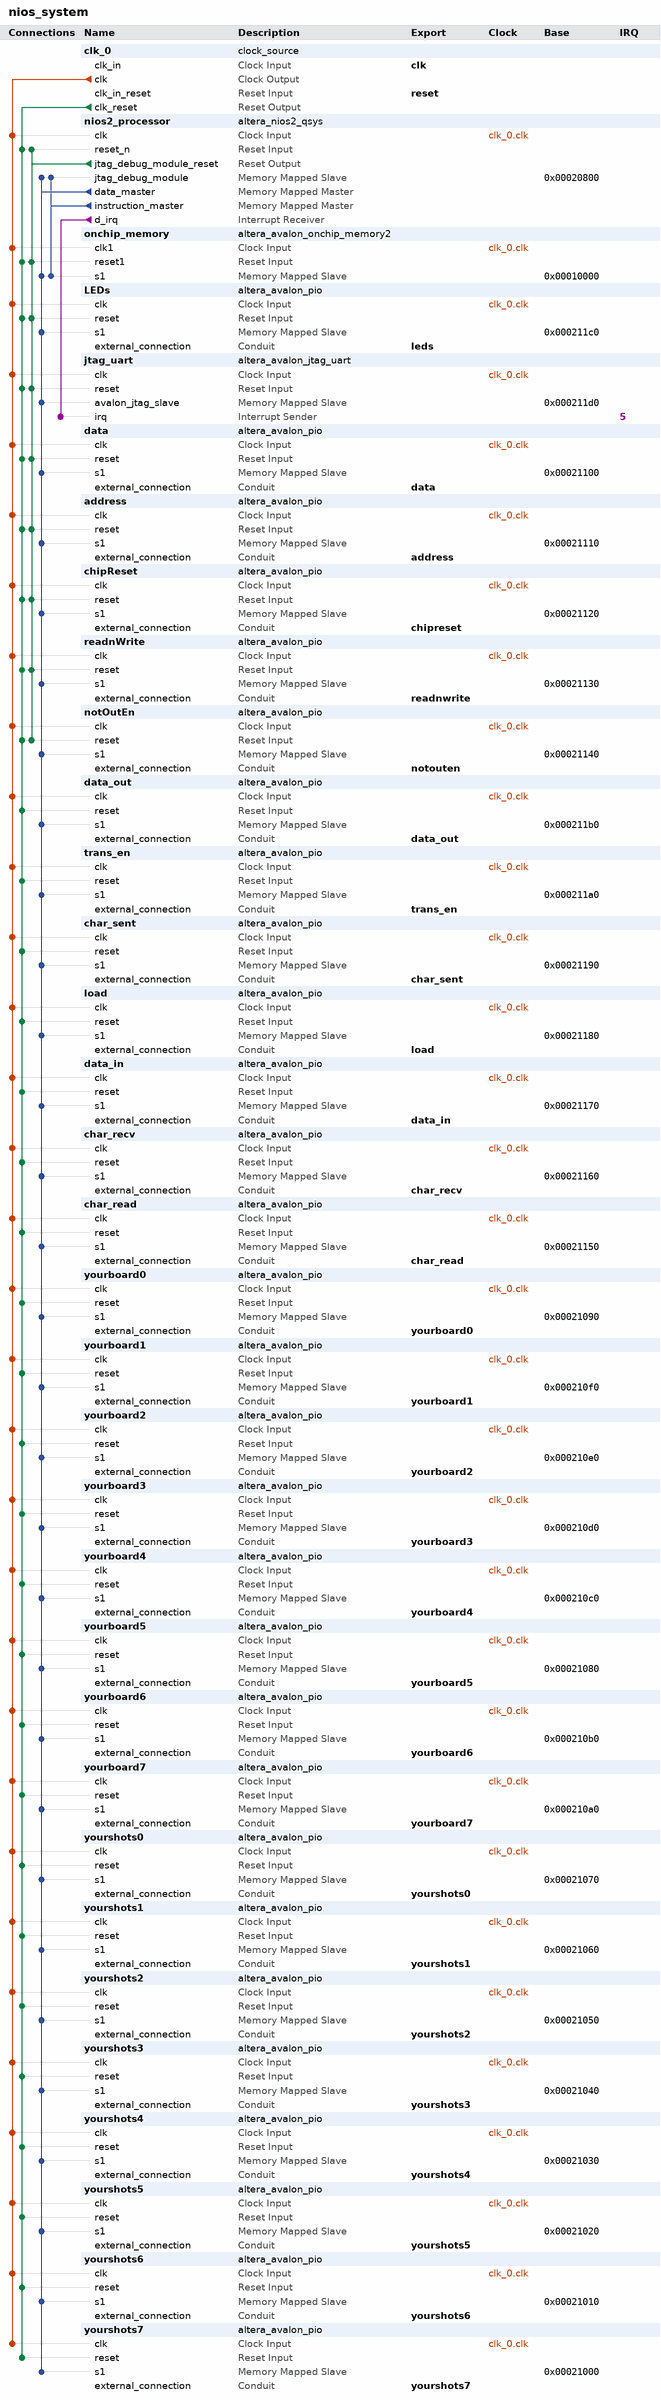
[diagram p0: system contents]
# Platform Designer (Qsys) system nios_system, Cyclone V 5CSEMA5F31C6
# Parameters at their usual value, and those the tool derives, are not listed.
package require -exact qsys 15.1
create_system nios_system
set_project_property DEVICE_FAMILY {Cyclone V}
set_project_property DEVICE 5CSEMA5F31C6

add_instance clk_0 clock_source 15.1
set_instance_parameter_value clk_0 clockFrequency 50000000

add_instance nios2_processor altera_nios2_qsys 15.1
set_instance_parameter_value nios2_processor breakSlave nios2_processor.jtag_debug_module
set_instance_parameter_value nios2_processor exceptionSlave onchip_memory.s1
set_instance_parameter_value nios2_processor icache_size 4096
set_instance_parameter_value nios2_processor impl Tiny
set_instance_parameter_value nios2_processor mmu_TLBMissExcSlave None
set_instance_parameter_value nios2_processor resetSlave onchip_memory.s1
set_instance_parameter_value nios2_processor resetrequest_enabled true

add_instance onchip_memory altera_avalon_onchip_memory2 15.1
set_instance_parameter_value onchip_memory dataWidth 32
set_instance_parameter_value onchip_memory dualPort false
set_instance_parameter_value onchip_memory initMemContent true
set_instance_parameter_value onchip_memory initializationFileName onchip_mem.hex
set_instance_parameter_value onchip_memory memorySize 65536

add_instance LEDs altera_avalon_pio 15.1
set_instance_parameter_value LEDs direction Output
set_instance_parameter_value LEDs width 8

add_instance jtag_uart altera_avalon_jtag_uart 15.1
set_instance_parameter_value jtag_uart simInteractiveOptions NO_INTERACTIVE_WINDOWS

add_instance data altera_avalon_pio 15.1
set_instance_parameter_value data direction Bidir
set_instance_parameter_value data width 8

add_instance address altera_avalon_pio 15.1
set_instance_parameter_value address direction Output
set_instance_parameter_value address width 11

add_instance chipReset altera_avalon_pio 15.1
set_instance_parameter_value chipReset direction Output
set_instance_parameter_value chipReset width 1

add_instance readnWrite altera_avalon_pio 15.1
set_instance_parameter_value readnWrite direction Output
set_instance_parameter_value readnWrite width 1

add_instance notOutEn altera_avalon_pio 15.1
set_instance_parameter_value notOutEn direction Output
set_instance_parameter_value notOutEn width 1

add_instance data_out altera_avalon_pio 15.1
set_instance_parameter_value data_out direction Output
set_instance_parameter_value data_out width 8

add_instance trans_en altera_avalon_pio 15.1
set_instance_parameter_value trans_en direction Output
set_instance_parameter_value trans_en width 1

add_instance char_sent altera_avalon_pio 15.1
set_instance_parameter_value char_sent direction Input
set_instance_parameter_value char_sent width 1

add_instance load altera_avalon_pio 15.1
set_instance_parameter_value load direction Output
set_instance_parameter_value load width 1

add_instance data_in altera_avalon_pio 15.1
set_instance_parameter_value data_in direction Input
set_instance_parameter_value data_in width 8

add_instance char_recv altera_avalon_pio 15.1
set_instance_parameter_value char_recv direction Input
set_instance_parameter_value char_recv width 1

add_instance char_read altera_avalon_pio 15.1
set_instance_parameter_value char_read direction Output
set_instance_parameter_value char_read width 1

add_instance yourboard0 altera_avalon_pio 15.1
set_instance_parameter_value yourboard0 direction Output
set_instance_parameter_value yourboard0 width 8

add_instance yourboard1 altera_avalon_pio 15.1
set_instance_parameter_value yourboard1 direction Output
set_instance_parameter_value yourboard1 width 8

add_instance yourboard2 altera_avalon_pio 15.1
set_instance_parameter_value yourboard2 direction Output
set_instance_parameter_value yourboard2 width 8

add_instance yourboard3 altera_avalon_pio 15.1
set_instance_parameter_value yourboard3 direction Output
set_instance_parameter_value yourboard3 width 8

add_instance yourboard4 altera_avalon_pio 15.1
set_instance_parameter_value yourboard4 direction Output
set_instance_parameter_value yourboard4 width 8

add_instance yourboard5 altera_avalon_pio 15.1
set_instance_parameter_value yourboard5 direction Output
set_instance_parameter_value yourboard5 width 8

add_instance yourboard6 altera_avalon_pio 15.1
set_instance_parameter_value yourboard6 direction Output
set_instance_parameter_value yourboard6 width 8

add_instance yourboard7 altera_avalon_pio 15.1
set_instance_parameter_value yourboard7 direction Output
set_instance_parameter_value yourboard7 width 8

add_instance yourshots0 altera_avalon_pio 15.1
set_instance_parameter_value yourshots0 direction Output
set_instance_parameter_value yourshots0 width 8

add_instance yourshots1 altera_avalon_pio 15.1
set_instance_parameter_value yourshots1 direction Output
set_instance_parameter_value yourshots1 width 8

add_instance yourshots2 altera_avalon_pio 15.1
set_instance_parameter_value yourshots2 direction Output
set_instance_parameter_value yourshots2 width 8

add_instance yourshots3 altera_avalon_pio 15.1
set_instance_parameter_value yourshots3 direction Output
set_instance_parameter_value yourshots3 width 8

add_instance yourshots4 altera_avalon_pio 15.1
set_instance_parameter_value yourshots4 direction Output
set_instance_parameter_value yourshots4 width 8

add_instance yourshots5 altera_avalon_pio 15.1
set_instance_parameter_value yourshots5 direction Output
set_instance_parameter_value yourshots5 width 8

add_instance yourshots6 altera_avalon_pio 15.1
set_instance_parameter_value yourshots6 direction Output
set_instance_parameter_value yourshots6 width 8

add_instance yourshots7 altera_avalon_pio 15.1
set_instance_parameter_value yourshots7 direction Output
set_instance_parameter_value yourshots7 width 8

# connections
add_connection clk_0.clk address.clk clock
add_connection clk_0.clk char_read.clk clock
add_connection clk_0.clk char_recv.clk clock
add_connection clk_0.clk char_sent.clk clock
add_connection clk_0.clk chipReset.clk clock
add_connection clk_0.clk data.clk clock
add_connection clk_0.clk data_in.clk clock
add_connection clk_0.clk data_out.clk clock
add_connection clk_0.clk jtag_uart.clk clock
add_connection clk_0.clk LEDs.clk clock
add_connection clk_0.clk load.clk clock
add_connection clk_0.clk nios2_processor.clk clock
add_connection clk_0.clk notOutEn.clk clock
add_connection clk_0.clk onchip_memory.clk1 clock
add_connection clk_0.clk readnWrite.clk clock
add_connection clk_0.clk trans_en.clk clock
add_connection clk_0.clk yourboard0.clk clock
add_connection clk_0.clk yourboard1.clk clock
add_connection clk_0.clk yourboard2.clk clock
add_connection clk_0.clk yourboard3.clk clock
add_connection clk_0.clk yourboard4.clk clock
add_connection clk_0.clk yourboard5.clk clock
add_connection clk_0.clk yourboard6.clk clock
add_connection clk_0.clk yourboard7.clk clock
add_connection clk_0.clk yourshots0.clk clock
add_connection clk_0.clk yourshots1.clk clock
add_connection clk_0.clk yourshots2.clk clock
add_connection clk_0.clk yourshots3.clk clock
add_connection clk_0.clk yourshots4.clk clock
add_connection clk_0.clk yourshots5.clk clock
add_connection clk_0.clk yourshots6.clk clock
add_connection clk_0.clk yourshots7.clk clock
add_connection clk_0.clk_reset address.reset reset
add_connection clk_0.clk_reset char_read.reset reset
add_connection clk_0.clk_reset char_recv.reset reset
add_connection clk_0.clk_reset char_sent.reset reset
add_connection clk_0.clk_reset chipReset.reset reset
add_connection clk_0.clk_reset data.reset reset
add_connection clk_0.clk_reset data_in.reset reset
add_connection clk_0.clk_reset data_out.reset reset
add_connection clk_0.clk_reset jtag_uart.reset reset
add_connection clk_0.clk_reset LEDs.reset reset
add_connection clk_0.clk_reset load.reset reset
add_connection clk_0.clk_reset nios2_processor.reset_n reset
add_connection clk_0.clk_reset notOutEn.reset reset
add_connection clk_0.clk_reset onchip_memory.reset1 reset
add_connection clk_0.clk_reset readnWrite.reset reset
add_connection clk_0.clk_reset trans_en.reset reset
add_connection clk_0.clk_reset yourboard0.reset reset
add_connection clk_0.clk_reset yourboard1.reset reset
add_connection clk_0.clk_reset yourboard2.reset reset
add_connection clk_0.clk_reset yourboard3.reset reset
add_connection clk_0.clk_reset yourboard4.reset reset
add_connection clk_0.clk_reset yourboard5.reset reset
add_connection clk_0.clk_reset yourboard6.reset reset
add_connection clk_0.clk_reset yourboard7.reset reset
add_connection clk_0.clk_reset yourshots0.reset reset
add_connection clk_0.clk_reset yourshots1.reset reset
add_connection clk_0.clk_reset yourshots2.reset reset
add_connection clk_0.clk_reset yourshots3.reset reset
add_connection clk_0.clk_reset yourshots4.reset reset
add_connection clk_0.clk_reset yourshots5.reset reset
add_connection clk_0.clk_reset yourshots6.reset reset
add_connection clk_0.clk_reset yourshots7.reset reset
add_connection nios2_processor.jtag_debug_module_reset address.reset reset
add_connection nios2_processor.jtag_debug_module_reset chipReset.reset reset
add_connection nios2_processor.jtag_debug_module_reset data.reset reset
add_connection nios2_processor.jtag_debug_module_reset jtag_uart.reset reset
add_connection nios2_processor.jtag_debug_module_reset LEDs.reset reset
add_connection nios2_processor.jtag_debug_module_reset nios2_processor.reset_n reset
add_connection nios2_processor.jtag_debug_module_reset notOutEn.reset reset
add_connection nios2_processor.jtag_debug_module_reset onchip_memory.reset1 reset
add_connection nios2_processor.jtag_debug_module_reset readnWrite.reset reset
add_connection nios2_processor.data_master address.s1 avalon
set_connection_parameter_value nios2_processor.data_master/address.s1 baseAddress 0x00021110
add_connection nios2_processor.data_master char_read.s1 avalon
set_connection_parameter_value nios2_processor.data_master/char_read.s1 baseAddress 0x00021150
add_connection nios2_processor.data_master char_recv.s1 avalon
set_connection_parameter_value nios2_processor.data_master/char_recv.s1 baseAddress 0x00021160
add_connection nios2_processor.data_master char_sent.s1 avalon
set_connection_parameter_value nios2_processor.data_master/char_sent.s1 baseAddress 0x00021190
add_connection nios2_processor.data_master chipReset.s1 avalon
set_connection_parameter_value nios2_processor.data_master/chipReset.s1 baseAddress 0x00021120
add_connection nios2_processor.data_master data.s1 avalon
set_connection_parameter_value nios2_processor.data_master/data.s1 baseAddress 0x00021100
add_connection nios2_processor.data_master data_in.s1 avalon
set_connection_parameter_value nios2_processor.data_master/data_in.s1 baseAddress 0x00021170
add_connection nios2_processor.data_master data_out.s1 avalon
set_connection_parameter_value nios2_processor.data_master/data_out.s1 baseAddress 0x000211b0
add_connection nios2_processor.data_master jtag_uart.avalon_jtag_slave avalon
set_connection_parameter_value nios2_processor.data_master/jtag_uart.avalon_jtag_slave baseAddress 0x000211d0
add_connection nios2_processor.data_master LEDs.s1 avalon
set_connection_parameter_value nios2_processor.data_master/LEDs.s1 baseAddress 0x000211c0
add_connection nios2_processor.data_master load.s1 avalon
set_connection_parameter_value nios2_processor.data_master/load.s1 baseAddress 0x00021180
add_connection nios2_processor.data_master nios2_processor.jtag_debug_module avalon
set_connection_parameter_value nios2_processor.data_master/nios2_processor.jtag_debug_module baseAddress 0x00020800
add_connection nios2_processor.data_master notOutEn.s1 avalon
set_connection_parameter_value nios2_processor.data_master/notOutEn.s1 baseAddress 0x00021140
add_connection nios2_processor.data_master onchip_memory.s1 avalon
set_connection_parameter_value nios2_processor.data_master/onchip_memory.s1 baseAddress 0x00010000
add_connection nios2_processor.data_master readnWrite.s1 avalon
set_connection_parameter_value nios2_processor.data_master/readnWrite.s1 baseAddress 0x00021130
add_connection nios2_processor.data_master trans_en.s1 avalon
set_connection_parameter_value nios2_processor.data_master/trans_en.s1 baseAddress 0x000211a0
add_connection nios2_processor.data_master yourboard0.s1 avalon
set_connection_parameter_value nios2_processor.data_master/yourboard0.s1 baseAddress 0x00021090
add_connection nios2_processor.data_master yourboard1.s1 avalon
set_connection_parameter_value nios2_processor.data_master/yourboard1.s1 baseAddress 0x000210f0
add_connection nios2_processor.data_master yourboard2.s1 avalon
set_connection_parameter_value nios2_processor.data_master/yourboard2.s1 baseAddress 0x000210e0
add_connection nios2_processor.data_master yourboard3.s1 avalon
set_connection_parameter_value nios2_processor.data_master/yourboard3.s1 baseAddress 0x000210d0
add_connection nios2_processor.data_master yourboard4.s1 avalon
set_connection_parameter_value nios2_processor.data_master/yourboard4.s1 baseAddress 0x000210c0
add_connection nios2_processor.data_master yourboard5.s1 avalon
set_connection_parameter_value nios2_processor.data_master/yourboard5.s1 baseAddress 0x00021080
add_connection nios2_processor.data_master yourboard6.s1 avalon
set_connection_parameter_value nios2_processor.data_master/yourboard6.s1 baseAddress 0x000210b0
add_connection nios2_processor.data_master yourboard7.s1 avalon
set_connection_parameter_value nios2_processor.data_master/yourboard7.s1 baseAddress 0x000210a0
add_connection nios2_processor.data_master yourshots0.s1 avalon
set_connection_parameter_value nios2_processor.data_master/yourshots0.s1 baseAddress 0x00021070
add_connection nios2_processor.data_master yourshots1.s1 avalon
set_connection_parameter_value nios2_processor.data_master/yourshots1.s1 baseAddress 0x00021060
add_connection nios2_processor.data_master yourshots2.s1 avalon
set_connection_parameter_value nios2_processor.data_master/yourshots2.s1 baseAddress 0x00021050
add_connection nios2_processor.data_master yourshots3.s1 avalon
set_connection_parameter_value nios2_processor.data_master/yourshots3.s1 baseAddress 0x00021040
add_connection nios2_processor.data_master yourshots4.s1 avalon
set_connection_parameter_value nios2_processor.data_master/yourshots4.s1 baseAddress 0x00021030
add_connection nios2_processor.data_master yourshots5.s1 avalon
set_connection_parameter_value nios2_processor.data_master/yourshots5.s1 baseAddress 0x00021020
add_connection nios2_processor.data_master yourshots6.s1 avalon
set_connection_parameter_value nios2_processor.data_master/yourshots6.s1 baseAddress 0x00021010
add_connection nios2_processor.data_master yourshots7.s1 avalon
set_connection_parameter_value nios2_processor.data_master/yourshots7.s1 baseAddress 0x00021000
add_connection nios2_processor.instruction_master nios2_processor.jtag_debug_module avalon
set_connection_parameter_value nios2_processor.instruction_master/nios2_processor.jtag_debug_module baseAddress 0x00020800
add_connection nios2_processor.instruction_master onchip_memory.s1 avalon
set_connection_parameter_value nios2_processor.instruction_master/onchip_memory.s1 baseAddress 0x00010000
add_connection nios2_processor.d_irq jtag_uart.irq interrupt
set_connection_parameter_value nios2_processor.d_irq/jtag_uart.irq irqNumber 5

# exported interfaces
add_interface address conduit end
set_interface_property address EXPORT_OF address.external_connection
add_interface char_read conduit end
set_interface_property char_read EXPORT_OF char_read.external_connection
add_interface char_recv conduit end
set_interface_property char_recv EXPORT_OF char_recv.external_connection
add_interface char_sent conduit end
set_interface_property char_sent EXPORT_OF char_sent.external_connection
add_interface chipreset conduit end
set_interface_property chipreset EXPORT_OF chipReset.external_connection
add_interface clk clock sink
set_interface_property clk EXPORT_OF clk_0.clk_in
add_interface data conduit end
set_interface_property data EXPORT_OF data.external_connection
add_interface data_in conduit end
set_interface_property data_in EXPORT_OF data_in.external_connection
add_interface data_out conduit end
set_interface_property data_out EXPORT_OF data_out.external_connection
add_interface leds conduit end
set_interface_property leds EXPORT_OF LEDs.external_connection
add_interface load conduit end
set_interface_property load EXPORT_OF load.external_connection
add_interface notouten conduit end
set_interface_property notouten EXPORT_OF notOutEn.external_connection
add_interface readnwrite conduit end
set_interface_property readnwrite EXPORT_OF readnWrite.external_connection
add_interface reset reset sink
set_interface_property reset EXPORT_OF clk_0.clk_in_reset
add_interface trans_en conduit end
set_interface_property trans_en EXPORT_OF trans_en.external_connection
add_interface yourboard0 conduit end
set_interface_property yourboard0 EXPORT_OF yourboard0.external_connection
add_interface yourboard1 conduit end
set_interface_property yourboard1 EXPORT_OF yourboard1.external_connection
add_interface yourboard2 conduit end
set_interface_property yourboard2 EXPORT_OF yourboard2.external_connection
add_interface yourboard3 conduit end
set_interface_property yourboard3 EXPORT_OF yourboard3.external_connection
add_interface yourboard4 conduit end
set_interface_property yourboard4 EXPORT_OF yourboard4.external_connection
add_interface yourboard5 conduit end
set_interface_property yourboard5 EXPORT_OF yourboard5.external_connection
add_interface yourboard6 conduit end
set_interface_property yourboard6 EXPORT_OF yourboard6.external_connection
add_interface yourboard7 conduit end
set_interface_property yourboard7 EXPORT_OF yourboard7.external_connection
add_interface yourshots0 conduit end
set_interface_property yourshots0 EXPORT_OF yourshots0.external_connection
add_interface yourshots1 conduit end
set_interface_property yourshots1 EXPORT_OF yourshots1.external_connection
add_interface yourshots2 conduit end
set_interface_property yourshots2 EXPORT_OF yourshots2.external_connection
add_interface yourshots3 conduit end
set_interface_property yourshots3 EXPORT_OF yourshots3.external_connection
add_interface yourshots4 conduit end
set_interface_property yourshots4 EXPORT_OF yourshots4.external_connection
add_interface yourshots5 conduit end
set_interface_property yourshots5 EXPORT_OF yourshots5.external_connection
add_interface yourshots6 conduit end
set_interface_property yourshots6 EXPORT_OF yourshots6.external_connection
add_interface yourshots7 conduit end
set_interface_property yourshots7 EXPORT_OF yourshots7.external_connection

set_interconnect_requirement {$system} qsys_mm.clockCrossingAdapter HANDSHAKE
set_interconnect_requirement {$system} qsys_mm.enableEccProtection FALSE
set_interconnect_requirement {$system} qsys_mm.insertDefaultSlave FALSE
set_interconnect_requirement {$system} qsys_mm.maxAdditionalLatency 1

save_system nios_system.qsys
